# Altium schematic sheet SunS_Power_Unit.SchDoc: Power filtration
size A4
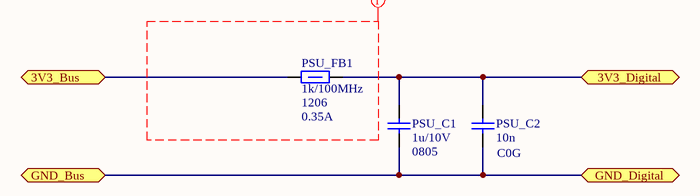
[diagram p0: SunS_Power_Unit.SchDoc]

## Parts
PSU_C1  value 1u/10V  Package: 0805  [SMD_Capacitor_0805]  (hidden comment: Cap)
PSU_C2  value 10n  Dielectric: C0G  [SMD_Capacitor_0402]  (hidden comment: Cap)
PSU_FB1  Package: 1206  Current Rating: 0.35A  [SMD_FerriteBead_1206]  (hidden comment: 1k/100MHz)

## Ports
3V3_Bus, 3V3_Digital, GND_Bus, GND_Digital

## Nets
3V3_Bus: PSU_FB1.2 ; port 3V3_Bus
3V3_Digital: PSU_C1.1 PSU_C2.1 PSU_FB1.1 ; port 3V3_Digital
GND_Bus: PSU_C1.2 PSU_C2.2 ; port GND_Digital, port GND_Bus

## Layout directives
net class PWR: (no net found under the mark)

## Notes on the sheet
- Title:
- Project:
- Author:
- Model:
- Document Number:
- Checked by:
- Rev:
- Date:
- Approved by:
- Sheet:
- of
- File name:

## Library data of the parts
PSU_FB1 = BLM15AX102SN1D: Ferrite bead, 0402, 0.49OHM, 0.35A.; Manufacturer: Murata; Series Resistance DC: 0.49R; ManufacturerPartNumber: BLM15AX102SN1D; Value: 1k/100MHz
PSU_C1 PSU_C2 = Cap
  PSU_C2: Package: 0402